# Altium schematic sheet Voltage_Reg_SBC.SchDoc: =SheetTitle
size B; SheetTitle: 60W SBC Buck-Boost Reg.; DrawnBy: Samyar Sadat Akhavi; DocumentNumber: 11; SheetNumber: 11; SheetTotal: 19
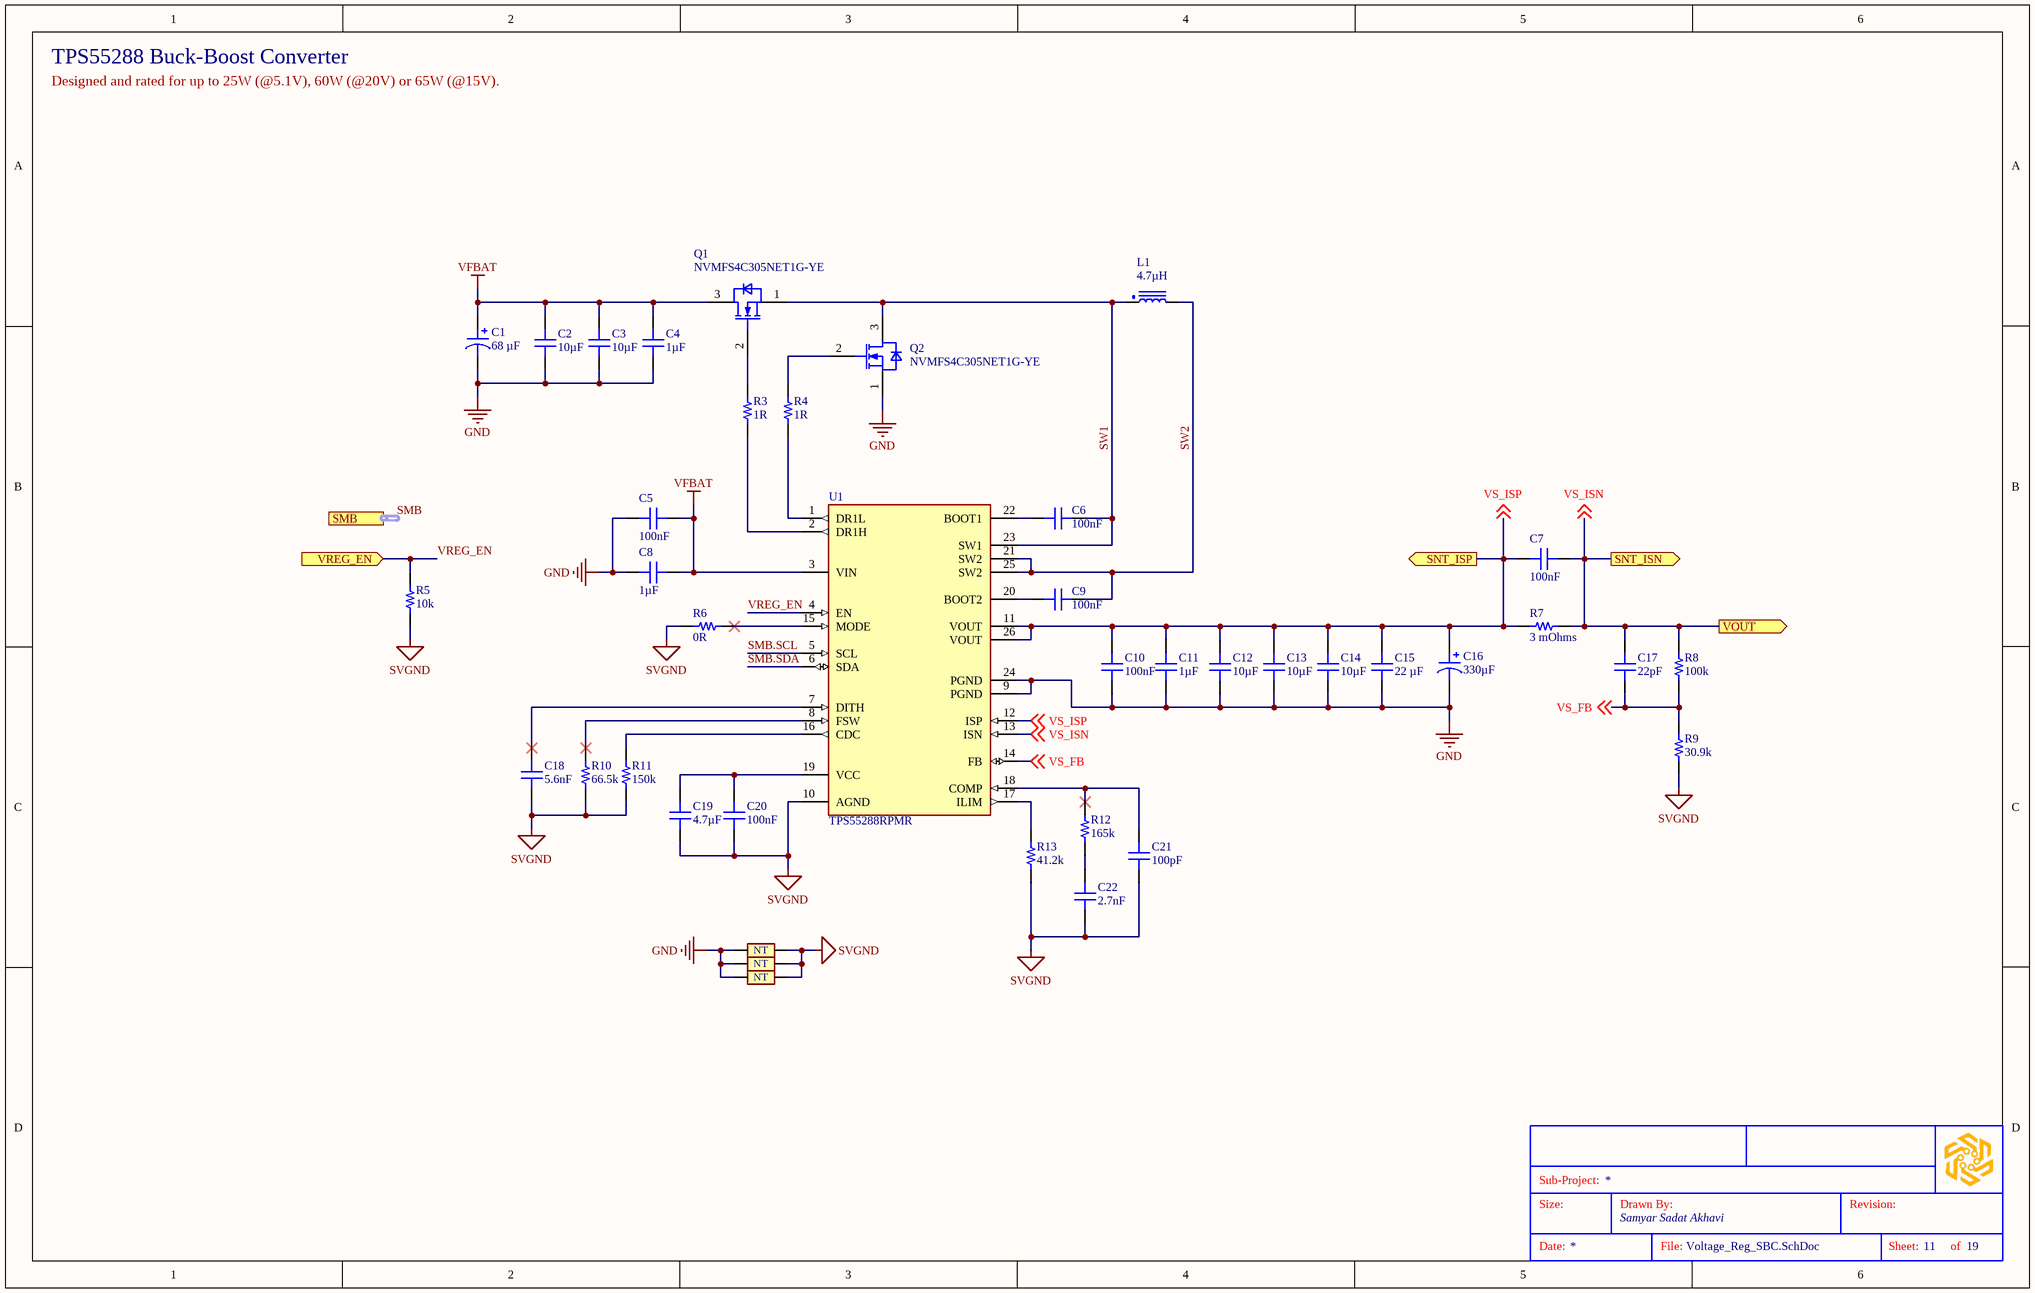
[diagram p0: Voltage_Reg_SBC.SchDoc]

## Parts
?  (no value)  (graphical)
C1  68 µF  [CAP ALSMD 6.6MM H7.7MM]
C2  10µF  [CAP 1206_3216]
C3  10µF  [CAP 1206_3216]
C4  1µF  [CAP 0603_1608]
C5  100nF  [CAP 0603_1608]
C6  100nF  [CAP 0603_1608]
C7  100nF  [CAP 0603_1608]
C8  1µF  [CAP 0603_1608]
C9  100nF  [CAP 0603_1608]
C10  100nF  [CAP 0603_1608]
C11  1µF  [CAP 0603_1608]
C12  10µF  [CAP 1206_3216]
C13  10µF  [CAP 1206_3216]
C14  10µF  [CAP 1206_3216]
C15  22 µF  [CAP 1206_3216 - 0.8MM]
C16  330µF  [CAPAE830X1250N]
C17  22pF  [CAP 0603_1608]
C18  5.6nF  [CAP 0603_1608]
C19  4.7µF  [CAP 1206_3216]
C20  100nF  [CAP 0603_1608]
C21  100pF  [CAP 0603_1608]
C22  2.7nF  [CAP 0603_1608]
L1  4.7µH  [WE-HCC_121021]
NT1  Net Tie  [Net_Tie_Via]  (value not drawn)  (net tie, no BOM)
NT2  Net Tie  [Net_Tie_Via]  (value not drawn)  (net tie, no BOM)
NT3  Net Tie  [Net_Tie_Via]  (value not drawn)  (net tie, no BOM)
Q1  NVMFS4C305NET1G-YE  [NVMFS4C05NWFET1G]
Q2  NVMFS4C305NET1G-YE  [NVMFS4C05NWFET1G]
R3  1R  [RES 0603_1608]
R4  1R  [RES 0603_1608]
R5  10k  [RES 0603_1608]
R6  0R  [RES 0603_1608]
R7  3 mOhms  [RES 2512_6432]
R8  100k  [RES 0603_1608]
R9  30.9k  [RES 0603_1608]
R10  66.5k  [RES 0603_1608]
R11  150k  [RES 0603_1608]
R12  165k  [RES 0603_1608]
R13  41.2k  [RES 0603_1608]
U1  TPS55288RPMR  [VQFN-HR26_RPM_TEX]

## Ports
SMB (harness SMBus, see Voltage_Regulators[1A], INA236_Sensor[3B], TMP112_Sensor[3B], Voltage_Reg_12V[2C], Voltage_Regulators[5D]), SNT_ISN (out, see Voltage_Regulators[2A]), SNT_ISP (out, see Voltage_Regulators[2A]), VOUT (out, see Voltage_Regulators[2A]), VREG_EN (in, see Voltage_Regulators[1A])

## Nets
GND: C1.2 C2.1 C3.1 C4.1 C5.1 C8.2 C10.1 C11.1 C12.1 C13.1 C14.1 C15.1 C16.2 NT1.1 NT2.1 NT3.1 Q2.1(SOURCE) U1.9(PGND) U1.24(PGND)
SVGND: C18.1 C19.1 C20.1 C21.1 C22.1 NT1.2 NT2.2 NT3.2 R5.2 R6.1 R9.1 R10.1 R11.1 R13.1 U1.10(AGND)
VFBAT: C1.1 C2.2 C3.2 C4.2 C5.2 C8.1 Q1.3(DRAIN) U1.3(VIN)
SMB.SCL: U1.5(SCL)
SMB.SDA: U1.6(SDA)
SW1: C6.1 L1.1 Q1.1(SOURCE) Q2.3(DRAIN) U1.23(SW1)
SW2: C9.1 L1.2 U1.21(SW2) U1.25(SW2)
VREG_EN: R5.1 U1.4(EN) ; port VREG_EN
VS_FB: C17.1 R8.1 R9.2 U1.14(FB) ; off-sheet VS_FB
VS_ISN: C7.2 C17.2 R7.2 R8.2 U1.13(ISN) ; off-sheet VS_ISN, port VOUT, port SNT_ISN
VS_ISP: C7.1 C10.2 C11.2 C12.2 C13.2 C14.2 C15.2 C16.1 R7.1 U1.11(VOUT) U1.12(ISP) U1.26(VOUT) ; off-sheet VS_ISP, port SNT_ISP
NetC6_2: C6.2 U1.22(BOOT1)
NetC9_2: C9.2 U1.20(BOOT2)
NetC18_2: C18.2 U1.7(DITH)
NetC19_2: C19.2 C20.2 U1.19(VCC)
NetC21_2: C21.2 R12.2 U1.18(COMP)
NetC22_2: C22.2 R12.1
NetQ1_2: Q1.2(GATE) R3.2
NetQ2_2: Q2.2(GATE) R4.2
NetR3_1: R3.1 U1.2(DR1H)
NetR4_1: R4.1 U1.1(DR1L)
NetR6_2: R6.2 U1.15(MODE)
NetR10_2: R10.2 U1.8(FSW)
NetR11_2: R11.2 U1.16(CDC)
NetR13_2: R13.2 U1.17(ILIM)

## Buses and harness runs
harness SMB = port SMB

## Notes on the sheet
- TPS55288 Buck-Boost Converter
- Designed and rated for up to 25W (@5.1V), 60W (@20V) or 65W (@15V).
- Sub-Project:
- Size:
- Drawn By:
- Revision:
- Date:
- File:
- Sheet:
- of
- (in symbol GEN-PCBVINT0S3) NT

## Library data of the parts
? = SGR-STDTBSB: STANDARD SCHEMATICS TITLE BLOCK
C1 = 865080545011: CAP ALUM 68UF 20% 35V SMD; manufacturer: Würth Elektronik; Impedance: 400 mOhms; Lifetime @ Temp.: 2000 Hrs @ 105°C; Polarization: Polar; Ripple Current @ High Frequency: 265 mA @ 100 kHz; Ripple Current @ Low Frequency: 172.25 mA @ 120 Hz; Surface Mount Land Size: 0.260" L x 0.260" W (6.60mm x 6.60mm); Part Number: 865080545011; Applications: General Purpose; Capacitance: 68 µF; componentlink1description: Datasheet; componentlink1url: https://katalog.we-online.de/pbs/datasheet/865080545011.pdf; componentlink2description: DigiKey Link; componentlink2url: https://www.digikey.com/en/products/detail/würth-elektronik/865080545011/5728105; Device Package: Radial, Can - SMD; Height - Seated (Max): 0.303" (7.70mm); lastupdated: 4/5/2026 8:54:40 PM; Lifecycle Status: Active; Minimum Order: 1; Mounting Type: Surface Mount; Operating Temperature: -55°C ~ 105°C; Package / Case: Radial, Can - SMD; packaging: TapeAndReel; partid: 27323; Part Status: Active; price: 0.17; series: WCAP-ASLI; Size / Dimension: 0.248" Dia (6.30mm); Supplier 1: DigiKey; Supplier Part Number 1: 732-8510-1-ND; Tolerance: ±20%; value: 68 µF; Voltage - Rated: 35 V
C2 C3 C12-C14 = GEN-CC10UT10V25KX7R1206: GENERIC 1206 MLC CAPACITOR; Tolerance: ±10%; Voltage: 25V; Dielectric: X7R; Part Number: GEN-CC10UT10V25KX7R1206; Value: 10µF
C4 C8 C11 = GEN-CC1UT10V25KX7R603: GENERIC 0603 MLC CAPACITOR; Tolerance: ±10%; Voltage: 25V; Dielectric: X7R; Part Number: GEN-CC1UT10V25KX7R603; Value: 1µF
C5-C7 C9 C10 C20 = GEN-CC100NT10V50KX7R603: GENERIC 0603 MLC CAPACITOR; Tolerance: ±10%; Voltage: 50V; Dielectric: X7R; Part Number: GEN-CC100NT10V50KX7R603; Value: 100nF
C15 = CL31A226KAHNNNE: CAP CER 22UF 25V X5R 1206; manufacturer: Samsung Electro-Mechanics; Tolerance: ±10%; Part Number: CL31A226KAHNNNE; Capacitance: 22 µF; Applications: General Purpose; componentlink1description: Datasheet; componentlink1url: http://www.samsungsem.com/kr/support/product-search/mlcc/CL31A226KAHNNNE.jsp; componentlink2description: DigiKey Link; componentlink2url: https://www.digikey.com/en/products/detail/samsung-electro-mechanics/CL31A226KAHNNNE/3888705; Device Package: 1206 (3216 Metric); lastupdated: 4/6/2026 7:37:25 PM; Lifecycle Status: Active; Minimum Order: 1; Mounting Type: Surface Mount, MLCC; Operating Temperature: -55°C ~ 85°C; Package / Case: 1206 (3216 Metric); packaging: TapeAndReel; partid: 22185; Part Status: Active; price: 0.06; series: CL; Size / Dimension: 0.126" L x 0.063" W (3.20mm x 1.60mm); Supplier 1: DigiKey; Supplier Part Number 1: 1276-3047-1-ND; Temperature Coefficient: X5R; Thickness (Max): 0.071" (1.80mm); value: 22 µF; Voltage - Rated: 25V
C16 = A768KS337M1ELAS019: CAP ALUM POLY 330UF 20% 25V SMD; Manufacturer: KEMET; ESR: 19mOhm; Lifetime Temp: 2000 Hrs @ 125°C; Part Number: A768KS337M1ELAS019; Value: 330µF; Tolerance: ±20%; Voltage: 25V; Supplier 1: DigiKey; Supplier Part Number 1: 399-A768KS337M1ELAS019CT-ND
C17 = GEN-CC22PT10V16KX7R603: GENERIC 0603 MLC CAPACITOR; Tolerance: ±10%; Voltage: 16V; Dielectric: X7R; Part Number: GEN-CC22PT10V16KX7R603; Value: 22pF
C18 = GEN-CC5N6T10V50KX7R603: GENERIC 0603 MLC CAPACITOR; Tolerance: ±10%; Voltage: 50V; Dielectric: X7R; Part Number: GEN-CC5N6T10V50KX7R603; Value: 5.6nF
C19 = GEN-CC4U7T10V25KX7R1206: GENERIC 1206 MLC CAPACITOR; Tolerance: ±10%; Voltage: 25V; Dielectric: X7R; Part Number: GEN-CC4U7T10V25KX7R1206; Value: 4.7µF
C21 = GEN-CC100PT5V50KC0G603: GENERIC 0603 MLC CAPACITOR; Tolerance: ±5%; Voltage: 50V; Dielectric: C0G; Part Number: GEN-CC100PT5V50KC0G603; Value: 100pF
C22 = GEN-CC2N7T10V50KX7R603: GENERIC 0603 MLC CAPACITOR; Tolerance: ±10%; Voltage: 50V; Dielectric: X7R; Part Number: GEN-CC2N7T10V50KX7R603; Value: 2.7nF
L1 = 7443320470: FIXED IND 4.7UH 15.5A 7.9 MOHM; Manufacturer: Würth Elektronik; Tolerance: ±20%; Saturation Current: 17A; Part Number: 7443320470; Value: 4.7µH; Current Rating: 15.5A; DC Resistance: 7.9mOhm; Supplier 1: DigiKey; Supplier Part Number 1: 732-2142-1-ND
NT1-NT3 = GEN-PCBVINT0S3: VIA STYLE CIRCULAR NET TIE; Part Number: GEN-PCBVINT0S3; Size Variant: 0.3mm
Q1 Q2 = NVMFS4C305NET1G-YE: SINGLE N-CHANNEL LOGIC LEVEL POW; Manufacturer: onsemi; Part Number: NVMFS4C305NET1G-YE; Supplier 1: DigiKey; Supplier Part Number 1: 488-NVMFS4C305NET1G-YE-ND
R3 R4 = GEN-CRR1T1P8603: GENERIC 0603 CHIP RESISTOR; Tolerance: ±1%; Power: 0.125W; Part Number: GEN-CRR1T1P8603; Value: 1R
R5 = GEN-CRR10KT1P8603: GENERIC 0603 CHIP RESISTOR; Tolerance: ±1%; Power: 0.125W; Part Number: GEN-CRR10KT1P8603; Value: 10k
R6 = GEN-CRR0603: GENERIC 0603 CHIP RESISTOR (JUMPER); Part Number: GEN-CRR0603; Value: 0R
R7 = TLR3A20KR003FTDG: RES 0.003 OHM 1% 2W 2512; manufacturer: TE Connectivity Passive Product; Temperature Coefficient: ±150ppm/°C; Part Number: TLR3A20KR003FTDG; componentlink1description: Datasheet; componentlink1url: https://www.te.com/commerce/DocumentDelivery/DDEController?Action=srchrtrv&DocNm=1773449-3&DocType=DS&DocLang=English; componentlink2description: DigiKey Link; componentlink2url: http://digikey.com/product-detail/en/te-connectivity-passive-product/TLR3A20KR003FTDG/A131783CT-ND/8603913; Composition: Metal Foil; Device Package: 2512 (6432 Metric); Features: Current Sense; Height - Seated (Max): 0.024" (0.60mm); lastupdated: 9/2/2020 1:27:06 AM; Lifecycle Status: Active; Minimum Order: 1; Number of Terminations: 2; Operating Temperature: -55°C ~ 170°C; Package / Case: 2512 (6432 Metric); packaging: TapeAndReel; Part Status: Active; Power (Watts): 2W; price: 0.30; Resistance: 3 mOhms; series: TLR, CGS; Size / Dimension: 0.252" L x 0.126" W (6.40mm x 3.20mm); Supplier 1: DigiKey; Supplier Part Number 1: A131783CT-ND; Supplier Device Package: 2512; Tolerance: ±1%; value: 3 mOhms
R8 = GEN-CRR100KT1P8603: GENERIC 0603 CHIP RESISTOR; Tolerance: ±1%; Power: 0.125W; Part Number: GEN-CRR100KT1P8603; Value: 100k
R9 = GEN-CRR30K9T1P8603: GENERIC 0603 CHIP RESISTOR; Tolerance: ±1%; Power: 0.125W; Part Number: GEN-CRR30K9T1P8603; Value: 30.9k
R10 = GEN-CRR66K5T1P8603: GENERIC 0603 CHIP RESISTOR; Tolerance: ±1%; Power: 0.125W; Part Number: GEN-CRR66K5T1P8603; Value: 66.5k
R11 = GEN-CRR150KT1P8603: GENERIC 0603 CHIP RESISTOR; Tolerance: ±1%; Power: 0.125W; Part Number: GEN-CRR150KT1P8603; Value: 150k
R12 = GEN-CRR165KT1P8603: GENERIC 0603 CHIP RESISTOR; Tolerance: ±1%; Power: 0.125W; Part Number: GEN-CRR165KT1P8603; Value: 165k
R13 = GEN-CRR41K2T1P8603: GENERIC 0603 CHIP RESISTOR; Tolerance: ±1%; Power: 0.125W; Part Number: GEN-CRR41K2T1P8603; Value: 41.2k
U1 = TPS55288RPMR: 36V, 16A BUCK-BOOST CONVERTER WITH PPS CONTROL; Manufacturer: Texas Instruments; Copyright: Copyright (C) 2026 Ultra Librarian. All rights reserved.; Part Number: TPS55288RPMR; Supplier 1: DigiKey; Supplier Part Number 1: 296-TPS55288RPMRCT-ND